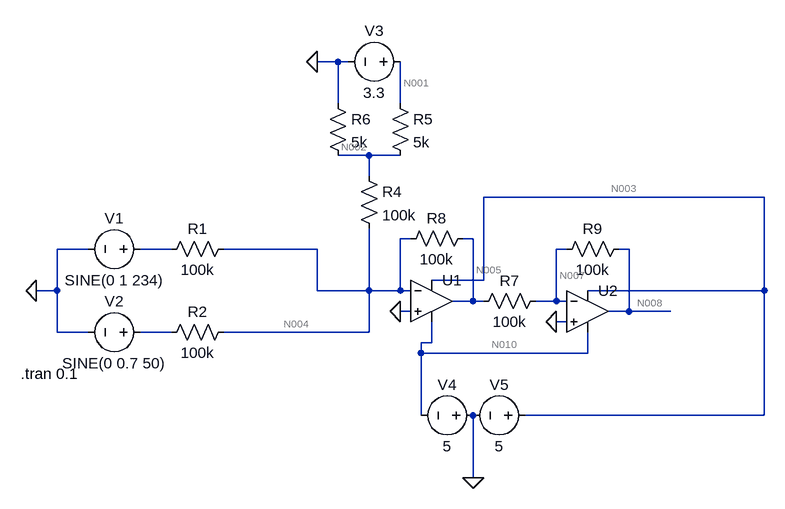
[diagram p0: schematic AuxAdderInverterCircuit.asc]
AuxAdderInverterCircuit.asc, the LTspice schematic file:
Version 4
SHEET 1 1048 680
WIRE 384 -144 352 -144
WIRE 400 -144 384 -144
WIRE 384 -80 384 -144
WIRE 480 -80 480 -144
WIRE 432 0 384 0
WIRE 480 0 432 0
WIRE 432 32 432 0
WIRE 1040 64 608 64
WIRE 496 128 480 128
WIRE 592 128 576 128
WIRE 0 144 -48 144
WIRE 128 144 80 144
WIRE 352 144 208 144
WIRE 736 144 720 144
WIRE 832 144 816 144
WIRE 608 192 608 64
WIRE 608 192 528 192
WIRE -48 208 -48 144
WIRE -48 208 -80 208
WIRE 352 208 352 144
WIRE 432 208 432 112
WIRE 432 208 352 208
WIRE 480 208 480 128
WIRE 480 208 432 208
WIRE 496 208 480 208
WIRE 1040 208 1040 64
WIRE 1040 208 768 208
WIRE 592 224 592 128
WIRE 592 224 560 224
WIRE 608 224 592 224
WIRE 720 224 720 144
WIRE 720 224 688 224
WIRE 736 224 720 224
WIRE 496 240 480 240
WIRE 832 240 832 144
WIRE 832 240 800 240
WIRE 896 240 832 240
WIRE 736 256 720 256
WIRE -48 272 -48 208
WIRE 0 272 -48 272
WIRE 128 272 80 272
WIRE 432 272 432 208
WIRE 432 272 208 272
WIRE 528 288 528 256
WIRE 528 288 512 288
WIRE 512 304 512 288
WIRE 768 304 768 272
WIRE 768 304 512 304
WIRE 512 400 512 304
WIRE 1040 400 1040 208
WIRE 1040 400 672 400
WIRE 592 496 592 400
FLAG -80 208 0
FLAG 480 240 0
FLAG 720 256 0
FLAG 352 -144 0
FLAG 592 496 0
SYMBOL voltage 96 144 R90
WINDOW 0 -32 56 VBottom 2
WINDOW 3 32 56 VTop 2
WINDOW 123 0 0 Left 0
WINDOW 39 0 0 Left 0
SYMATTR InstName V1
SYMATTR Value SINE(0 1 234)
SYMBOL voltage 96 272 R90
WINDOW 0 -32 56 VBottom 2
WINDOW 3 32 56 VTop 2
WINDOW 123 0 0 Left 0
WINDOW 39 0 0 Left 0
SYMATTR InstName V2
SYMATTR Value SINE(0 0.7 50)
SYMBOL res 224 128 R90
WINDOW 0 0 56 VBottom 2
WINDOW 3 32 56 VTop 2
SYMATTR InstName R1
SYMATTR Value 100k
SYMBOL res 224 256 R90
WINDOW 0 0 56 VBottom 2
WINDOW 3 32 56 VTop 2
SYMATTR InstName R2
SYMATTR Value 100k
SYMBOL OpAmps\\UniversalOpAmp 528 224 R0
SYMATTR InstName U1
SYMBOL OpAmps\\UniversalOpAmp 768 240 R0
SYMATTR InstName U2
SYMBOL res 416 16 R0
SYMATTR InstName R4
SYMATTR Value 100k
SYMBOL res 464 -96 R0
SYMATTR InstName R5
SYMATTR Value 5k
SYMBOL res 368 -96 R0
SYMATTR InstName R6
SYMATTR Value 5k
SYMBOL voltage 496 -144 R90
WINDOW 0 -32 56 VBottom 2
WINDOW 3 32 56 VTop 2
WINDOW 123 0 0 Left 0
WINDOW 39 0 0 Left 0
SYMATTR InstName V3
SYMATTR Value 3.3
SYMBOL res 704 208 R90
WINDOW 0 0 56 VBottom 2
WINDOW 3 32 56 VTop 2
SYMATTR InstName R7
SYMATTR Value 100k
SYMBOL res 480 144 R270
WINDOW 0 32 56 VTop 2
WINDOW 3 0 56 VBottom 2
SYMATTR InstName R8
SYMATTR Value 100k
SYMBOL res 832 128 R90
WINDOW 0 0 56 VBottom 2
WINDOW 3 32 56 VTop 2
SYMATTR InstName R9
SYMATTR Value 100k
SYMBOL voltage 608 400 R90
WINDOW 0 -32 56 VBottom 2
WINDOW 3 32 56 VTop 2
WINDOW 123 0 0 Left 0
WINDOW 39 0 0 Left 0
SYMATTR InstName V4
SYMATTR Value 5
SYMBOL voltage 688 400 R90
WINDOW 0 -32 56 VBottom 2
WINDOW 3 32 56 VTop 2
WINDOW 123 0 0 Left 0
WINDOW 39 0 0 Left 0
SYMATTR InstName V5
SYMATTR Value 5
TEXT -104 336 Left 2 !.tran 0.1

The netlist it stands for:
* AuxAdderInverterCircuit.asc
V1 N006 0 SINE(0 1 234)
V2 N009 0 SINE(0 0.7 50)
R1 N004 N006 100k
R2 N004 N009 100k
XU1 0 N004 N003 N010 N005 level1 Avol=1Meg GBW=10Meg Vos=0 En=0 Enk=0 In=0 Ink=0 Rin=500Meg  ; pins In+ In- V+ V- OUT
XU2 0 N007 N003 N010 N008 level1 Avol=1Meg GBW=10Meg Vos=0 En=0 Enk=0 In=0 Ink=0 Rin=500Meg  ; pins In+ In- V+ V- OUT
R4 N002 N004 100k
R5 N001 N002 5k
R6 0 N002 5k
V3 N001 0 3.3
R7 N007 N005 100k
R8 N004 N005 100k
R9 N008 N007 100k
V4 0 N010 5
V5 N003 0 5
.tran 0.1
.lib UniversalOpAmp1.lib
.backanno
.end

* Results of the author's LTspice run, read from the files saved beside the schematic
* Operating Point, zero values left out:
*   V(n004) = 1.61 µV
*   V(n005) = -1.61 V
*   V(n003) = 5 V
*   V(n010) = -5 V
*   V(n007) = -1.61 µV
*   V(n008) = 1.61 V
*   V(n002) = 1.61 V
*   V(n001) = 3.3 V
*   I(R9) = 16.1 µA
*   I(R8) = 16.1 µA
*   I(R7) = 16.1 µA
*   I(R6) = -322 µA
*   I(R5) = 338 µA
*   I(R4) = 16.1 µA
*   I(R2) = 16.1 pA
*   I(R1) = 16.1 pA
*   I(V5) = -20 nA
*   I(V4) = -20 nA
*   I(V3) = -338 µA
*   I(V2) = 16.1 pA
*   I(V1) = 16.1 pA
*   Ix(u1:3) = 10 nA
*   Ix(u1:4) = -10 nA
*   Ix(u1:5) = 32.2 µA
*   Ix(u2:3) = 10 nA
*   Ix(u2:4) = -10 nA
*   Ix(u2:5) = -16.1 µA